# Altium project Buttons board.PrjPCB
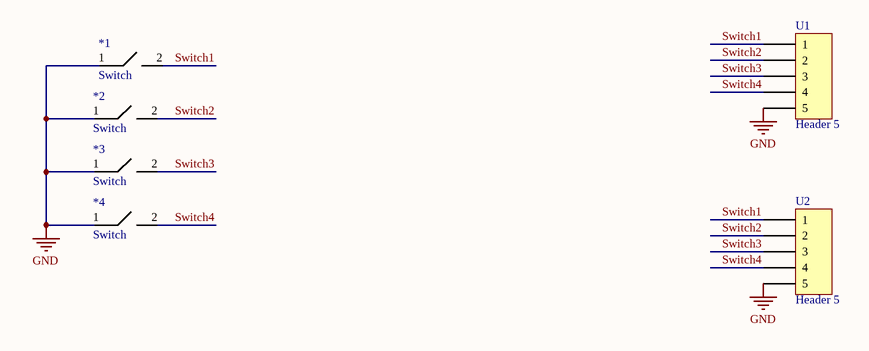
[diagram p0: Main sheet.SchDoc]
1 sheet, 6 parts. Net scope: global (net labels, ports and power ports of the same name join across sheets).
Board file: Buttons board.PcbDoc

## Sheet Main sheet.SchDoc
size A4

### Parts
*1  Switch  [Switch]
*2  Switch  [Switch]
*3  Switch  [Switch]
*4  Switch  [Switch]
U1  Header 5  [5x1.27]
U2  Header 5  [5x2.54]

### Nets
GND: *1.1 *2.1 *3.1 *4.1 U1.5 U2.5
Switch1: *1.2 U1.1 U2.1
Switch2: *2.2 U1.2 U2.2
Switch3: *3.2 U1.3 U2.3
Switch4: *4.2 U1.4 U2.4